# EAGLE schematic HIH6 (EAGLE 6.4)
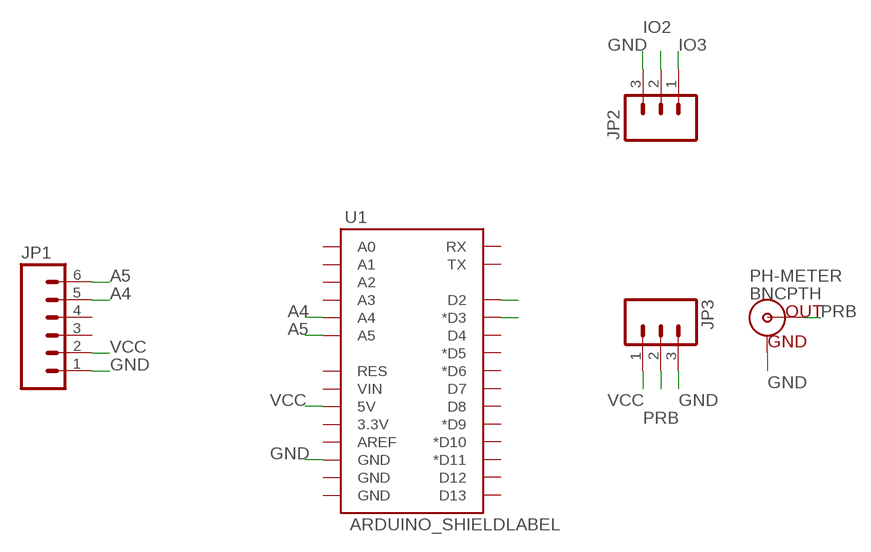
[diagram p0: schematic, sheet 1]

## Parts
JP1  M06LONGPADS  [1X06_LONGPADS]
JP2  M03LONGPADS  [1X03_LONGPADS]
JP3  M03LONGPADS  [1X03_LONGPADS]
PH-METER  BNCPTH  [BNC]
U1  ARDUINO_SHIELDLABEL  [DUEMILANOVE_SHIELD]

## Nets
A4: JP1.5 U1.A4
A5: JP1.6 U1.A5
GND: JP1.1 JP2.3 JP3.3 PH-METER.GND U1.GND@2(GND)
IO2: JP2.2 U1.D2
IO3: JP2.1 U1.D3(*D3)
PRB: JP3.2 PH-METER.S(OUT)
VCC: JP1.2 JP3.1 U1.5V
Unconnected: JP1.3 JP1.4 U1.3.3V U1.A0 U1.A1 U1.A2 U1.A3 U1.AREF U1.D4 U1.D5(*D5) U1.D6(*D6) U1.D7 U1.D8 U1.D9(*D9) U1.D10(*D10) U1.D11(*D11) U1.D12 U1.D13 U1.GND@0(GND) U1.GND@1(GND) U1.RES U1.RX U1.TX U1.VIN

## Library data of the parts
JP1 = SparkFun-Connectors:M06: Header 6 Standard 6-pin 0.1" header. Use with straight break away headers (SKU : PRT-00116), right angle break away headers (PRT-00553), swiss pins (PRT-00743), machine pins (PRT-00117), and female headers (PRT-00115). Molex polarized connector foot print use with SKU : PRT-08094 with associated crimp pins and housings. NOTES ON THE VARIANTS LOCK and LOCK_LONGPADS... This footprint was designed to help hold the alignment of a through-hole component (i.e. 6-pin header) while soldering it into place. You may notice that each hole has been shifted either up or down by 0.005 of an inch from it's more standard position (which is a perfectly straight line). This slight alteration caused the pins (the squares in the middle) to touch the edges of the holes. Because they are alternating, it causes a "brace" to hold the component in place. 0.005 has proven to be the perfect amount of "off-center" position when using our standard breakaway headers. Although looks a little odd when you look at the bare footprint, once you have a header in there, the alteration is very hard to notice. Also, if you push a header all the way into place, it is covered up entirely on the bottom side. This idea of altering the position of holes to aid alignment will be further integrated into the Sparkfun Library for other footprints. It can help hold any component with 3 or more connection pins.
JP2 JP3 = SparkFun-Connectors:M03: Header 3 Standard 3-pin 0.1" header. Use with straight break away headers (SKU : PRT-00116), right angle break away headers (PRT-00553), swiss pins (PRT-00743), machine pins (PRT-00117), and female headers (PRT-00115). Molex polarized connector foot print use with SKU : PRT-08232 with associated crimp pins and housings.
PH-METER = SparkFun-Connectors:BNC: BNC Connector, Mouser Part# 5227161
U1 = SparkFun-Boards:ARDUINO_SHIELD: Arduino shield footprint